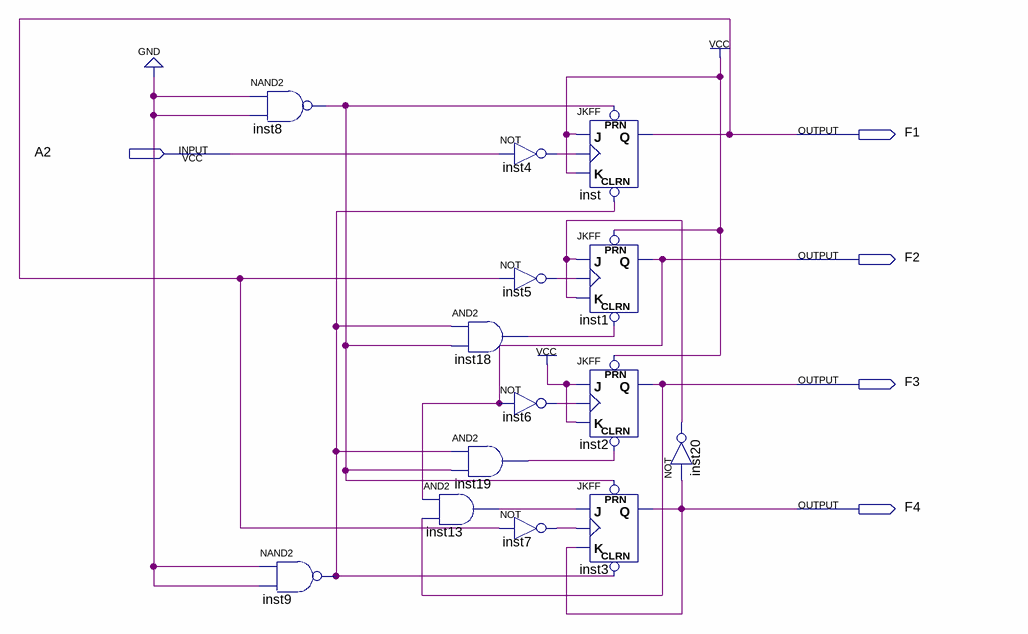
[diagram p0: schematic sheet]
// Quartus schematic AsynBinUp.bdf as structural Verilog: 14 symbols, 5 pins
module AsynBinUp (
  input  A2,
  output F1,
  output F2,
  output F3,
  output F4
);

  wire inst4_out, inst5_out, inst6_out, inst7_out, inst8_out, inst9_out, inst13_out, inst18_out, inst19_out,
       inst20_out;

  nand inst8 (inst8_out, 1'b0, 1'b0);
  nand inst9 (inst9_out, 1'b0, 1'b0);
  and inst13 (inst13_out, F2, F3);
  not inst4 (inst4_out, A2);
  not inst5 (inst5_out, F1);
  and inst18 (inst18_out, inst9_out, inst8_out);
  not inst6 (inst6_out, F2);
  and inst19 (inst19_out, inst9_out, inst8_out);
  not inst7 (inst7_out, F1);
  JKFF inst (.PRN(inst8_out), .CLRN(inst9_out), .K(1'b1), .J(1'b1), .CLK(inst4_out), .Q(F1));
  JKFF inst1 (.PRN(1'b1), .CLRN(inst18_out), .K(inst20_out), .J(inst20_out), .CLK(inst5_out), .Q(F2));
  JKFF inst2 (.PRN(1'b1), .CLRN(inst19_out), .K(1'b1), .J(1'b1), .CLK(inst6_out), .Q(F3));
  JKFF inst3 (.PRN(inst8_out), .CLRN(inst9_out), .K(F4), .J(inst13_out), .CLK(inst7_out), .Q(F4));
  not inst20 (inst20_out, F4);
endmodule
